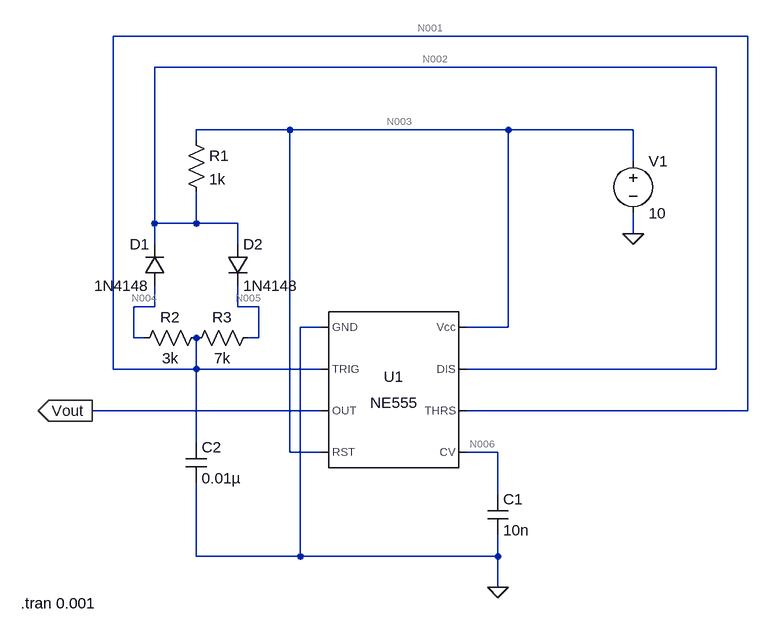
[diagram p0: schematic Sim_for_555.asc]
Sim_for_555.asc, the LTspice schematic file:
Version 4
SHEET 1 880 680
WIRE 720 -368 -256 -368
WIRE 672 -320 -192 -320
WIRE 16 -224 -128 -224
WIRE 352 -224 16 -224
WIRE 544 -224 352 -224
WIRE -128 -208 -128 -224
WIRE 544 -176 544 -224
WIRE -192 -80 -192 -320
WIRE -128 -80 -128 -128
WIRE -128 -80 -192 -80
WIRE -64 -80 -128 -80
WIRE 544 -64 544 -96
WIRE -192 -48 -192 -80
WIRE -64 -48 -64 -80
WIRE -192 48 -192 16
WIRE -192 48 -224 48
WIRE -64 48 -64 16
WIRE -32 48 -64 48
WIRE 64 80 32 80
WIRE 352 80 352 -224
WIRE 352 80 288 80
WIRE -224 96 -224 48
WIRE -208 96 -224 96
WIRE -32 96 -32 48
WIRE -32 96 -48 96
WIRE -256 144 -256 -368
WIRE -128 144 -128 96
WIRE -128 144 -256 144
WIRE 64 144 -128 144
WIRE 672 144 672 -320
WIRE 672 144 288 144
WIRE 64 208 -288 208
WIRE 720 208 720 -368
WIRE 720 208 288 208
WIRE -128 256 -128 144
WIRE 16 272 16 -224
WIRE 64 272 16 272
WIRE 336 272 288 272
WIRE 336 336 336 272
WIRE -128 432 -128 320
WIRE 32 432 32 80
WIRE 32 432 -128 432
WIRE 336 432 336 400
WIRE 336 432 32 432
WIRE 336 480 336 432
FLAG 544 -64 0
FLAG 336 480 0
FLAG -288 208 Vout
IOPIN -288 208 Out
SYMBOL Misc\\NE555 176 176 R0
SYMATTR InstName U1
SYMBOL voltage 544 -192 R0
WINDOW 123 0 0 Left 0
WINDOW 39 0 0 Left 0
SYMATTR InstName V1
SYMATTR Value 10
SYMBOL cap 320 336 R0
SYMATTR InstName C1
SYMATTR Value 10n
SYMBOL cap -144 256 R0
SYMATTR InstName C2
SYMATTR Value 0.01µ
SYMBOL diode -176 16 R180
WINDOW 0 24 64 Left 2
WINDOW 3 24 0 Left 2
SYMATTR InstName D1
SYMATTR Value 1N4148
SYMBOL diode -80 -48 R0
SYMATTR InstName D2
SYMATTR Value 1N4148
SYMBOL res -144 -224 R0
SYMATTR InstName R1
SYMATTR Value 1k
SYMBOL res -112 80 R90
WINDOW 0 0 56 VBottom 2
WINDOW 3 32 56 VTop 2
SYMATTR InstName R2
SYMATTR Value 3k
SYMBOL res -32 80 R90
WINDOW 0 0 56 VBottom 2
WINDOW 3 32 56 VTop 2
SYMATTR InstName R3
SYMATTR Value 7k
TEXT -398 504 Left 2 !.tran 0.001

The netlist it stands for:
* Sim_for_555.asc
XU1 0 N001 Vout N003 N006 N001 N002 N003 NE555  ; pins GND TRIG OUT RST CV THRS DIS Vcc
V1 N003 0 10
C1 N006 0 10n
C2 N001 0 0.01µ
D1 N004 N002 1N4148
D2 N002 N005 1N4148
R1 N003 N002 1k
R2 N001 N004 3k
R3 N005 N001 7k
.model D D
.lib standard.dio
.tran 0.001
.lib NE555.sub
.backanno
.end

* Results of the author's LTspice run, read from the files saved beside the schematic
* Operating Point, zero values left out:
*   V(n001) = 9.906 V
*   V(n006) = 6.667 V
*   V(n003) = 10 V
*   V(n002) = 10 V
*   V(vout) = 10 V
*   V(n004) = 9.906 V
*   V(n005) = 9.906 V
*   I(D2) = 17.61 nA
*   I(D1) = -2.206 nA
*   I(R3) = 17.61 nA
*   I(R2) = -2.206 nA
*   I(R1) = 33.15 nA
*   I(V1) = -3.233 mA
*   Ix(u1:1) = -3.233 mA
*   Ix(u1:2) = 9.906 nA
*   Ix(u1:4) = 56 µA
*   Ix(u1:6) = 9.906 nA
*   Ix(u1:7) = 13.34 nA
*   Ix(u1:8) = 3.177 mA
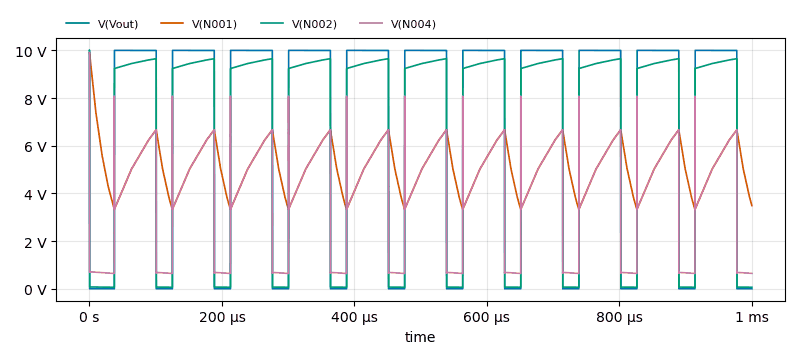
[diagram p1: Transient Analysis of Sim_for_555.asc, plotted from the saved traces]
* Transient Analysis, 1 run:
*   V(Vout): min 60 µV, max 10 V, average 6.951 V, rms 8.337 V, last 60 µV
*   V(N001): min 3.326 V, max 9.906 V, average 5.117 V, rms 5.251 V, last 3.49 V
*   V(N002): min 64.98 mV, max 10 V, average 6.609 V, rms 7.898 V, last 65.29 mV
*   V(N004): min 644.6 mV, max 9.906 V, average 3.812 V, rms 4.441 V, last 647.6 mV